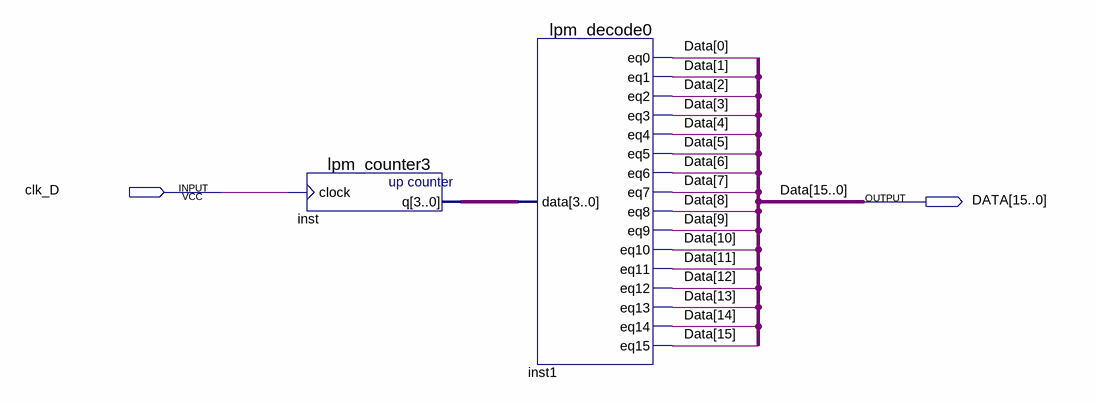
[diagram p0: schematic sheet]
// Quartus schematic BlockC.bdf as structural Verilog: 2 symbols, 2 pins
module BlockC (
  input  clk_D,
  output [15:0] DATA
);

  wire [3:0] inst_q;

  lpm_counter3 inst (.clock(clk_D), .q(inst_q));
  lpm_decode0 inst1 (
    .data(inst_q), .eq0(DATA[0]), .eq1(DATA[1]), .eq2(DATA[2]), .eq3(DATA[3]), .eq4(DATA[4]), .eq5(DATA[5]),
    .eq6(DATA[6]), .eq7(DATA[7]), .eq8(DATA[8]), .eq9(DATA[9]), .eq10(DATA[10]), .eq11(DATA[11]),
    .eq12(DATA[12]), .eq13(DATA[13]), .eq14(DATA[14]), .eq15(DATA[15]));
endmodule
